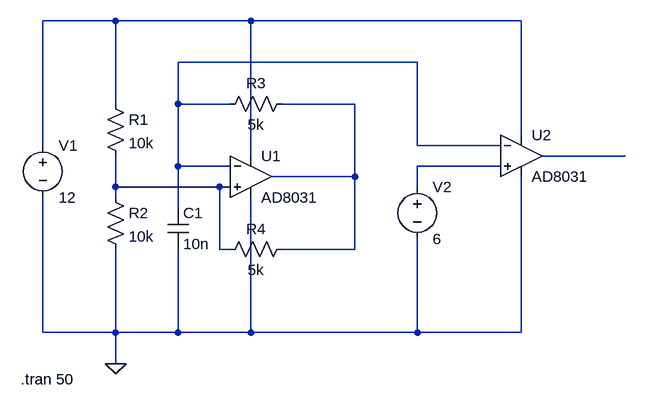
[diagram p0: schematic Lab_sim.asc]
Lab_sim.asc, the LTspice schematic file:
Version 4
SHEET 1 932 680
WIRE 144 -112 32 -112
WIRE 352 -112 144 -112
WIRE 768 -112 352 -112
WIRE 608 -48 240 -48
WIRE 144 16 144 -112
WIRE 240 16 240 -48
WIRE 320 16 240 16
WIRE 512 16 400 16
WIRE 768 64 768 -112
WIRE 32 80 32 -112
WIRE 608 80 608 -48
WIRE 736 80 608 80
WIRE 352 96 352 -112
WIRE 928 96 800 96
WIRE 240 112 240 16
WIRE 320 112 240 112
WIRE 736 112 608 112
WIRE 512 128 512 16
WIRE 512 128 384 128
WIRE 144 144 144 96
WIRE 304 144 144 144
WIRE 320 144 304 144
WIRE 608 144 608 112
WIRE 144 160 144 144
WIRE 240 176 240 112
WIRE 304 240 304 144
WIRE 320 240 304 240
WIRE 512 240 512 128
WIRE 512 240 400 240
WIRE 32 368 32 160
WIRE 144 368 144 240
WIRE 144 368 32 368
WIRE 240 368 240 240
WIRE 240 368 144 368
WIRE 352 368 352 160
WIRE 352 368 240 368
WIRE 608 368 608 224
WIRE 608 368 352 368
WIRE 768 368 768 128
WIRE 768 368 608 368
WIRE 144 416 144 368
FLAG 144 416 0
SYMBOL voltage 32 64 R0
WINDOW 123 0 0 Left 0
WINDOW 39 0 0 Left 0
SYMATTR InstName V1
SYMATTR Value 12
SYMBOL res 128 0 R0
SYMATTR InstName R1
SYMATTR Value 10k
SYMBOL res 128 144 R0
SYMATTR InstName R2
SYMATTR Value 10k
SYMBOL res 416 0 R90
WINDOW 0 0 56 VBottom 2
WINDOW 3 32 56 VTop 2
SYMATTR InstName R3
SYMATTR Value 5k
SYMBOL res 416 224 R90
WINDOW 0 0 56 VBottom 2
WINDOW 3 32 56 VTop 2
SYMATTR InstName R4
SYMATTR Value 5k
SYMBOL cap 224 176 R0
SYMATTR InstName C1
SYMATTR Value 10n
SYMBOL OpAmps\\AD8031 352 64 R0
SYMATTR InstName U1
SYMBOL OpAmps\\AD8031 768 32 R0
SYMATTR InstName U2
SYMBOL voltage 608 128 R0
SYMATTR InstName V2
SYMATTR Value 6
TEXT -2 440 Left 2 !.tran 50

The netlist it stands for:
* Lab_sim.asc
V1 N001 0 12
R1 N001 N006 10k
R2 N006 0 10k
R3 N003 N002 5k
R4 N003 N006 5k
C1 N002 0 10n
XU1 N006 N002 N001 0 N003 AD8031  ; pins In+ In- V+ V- OUT
XU2 N005 N002 N001 0 N004 AD8031  ; pins In+ In- V+ V- OUT
V2 N005 0 6
.tran 50
.backanno
.end